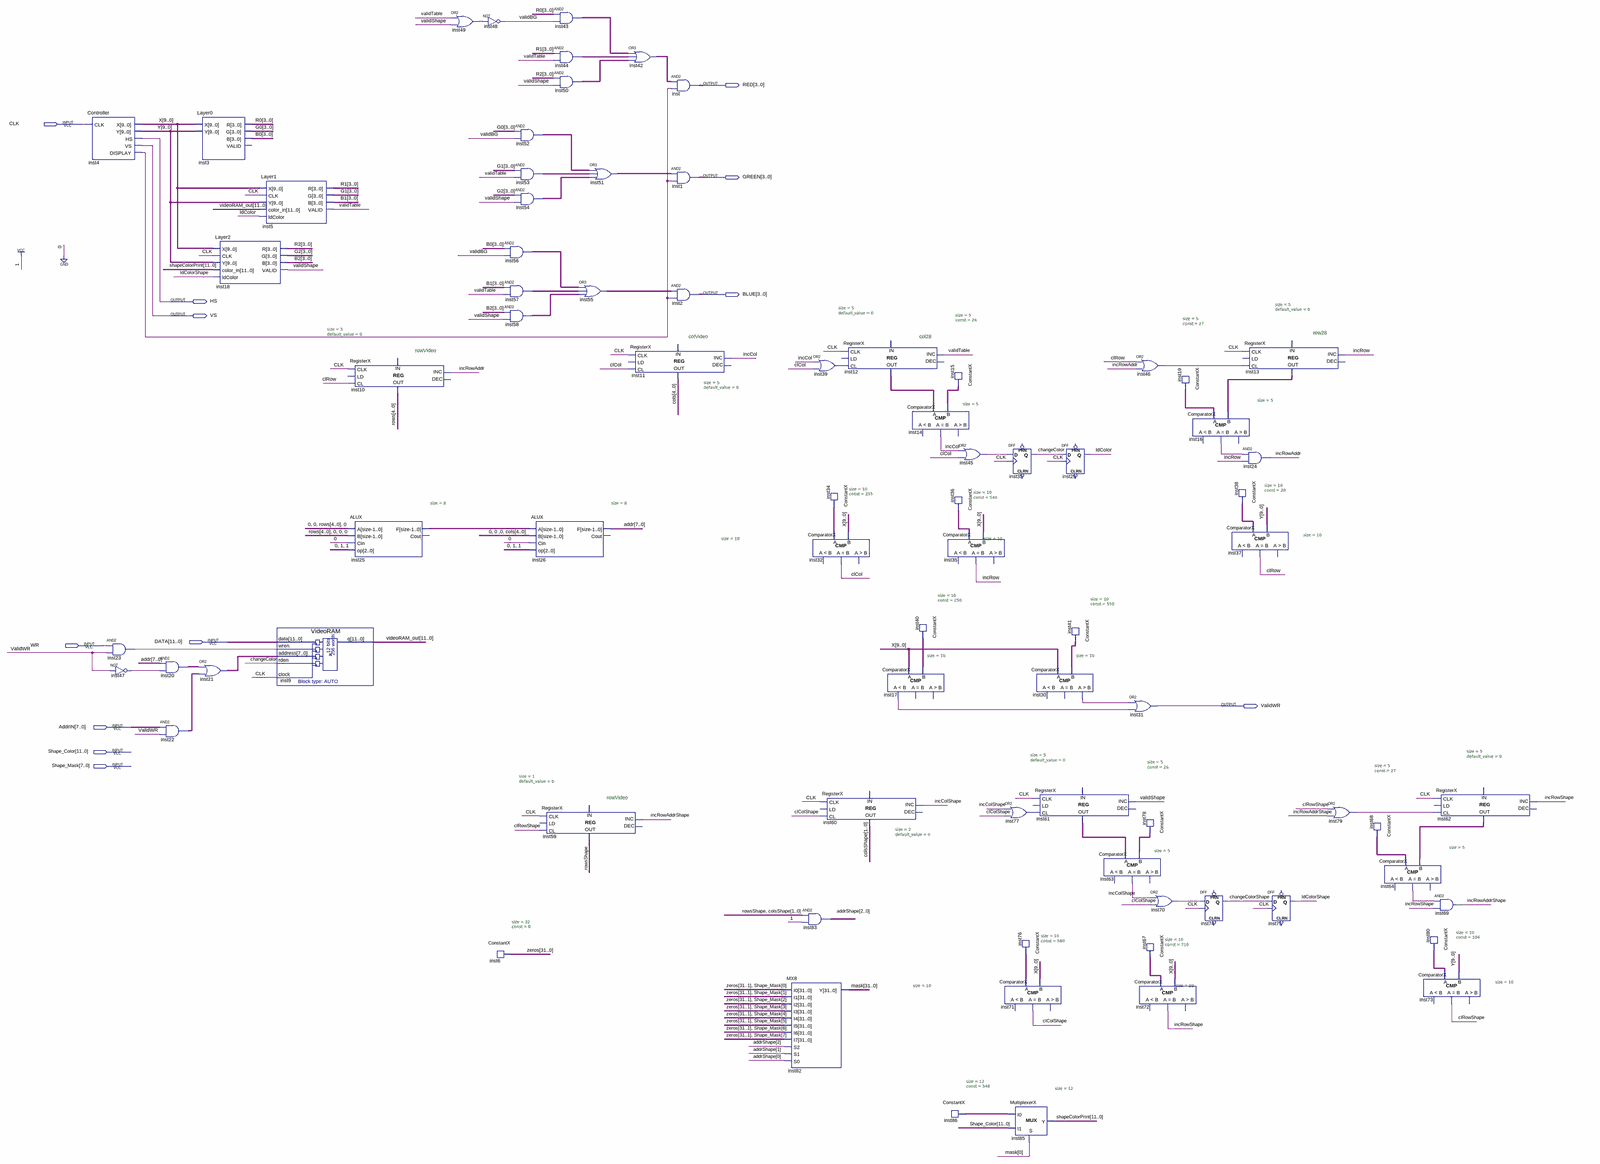
[diagram p0: schematic sheet, whole]
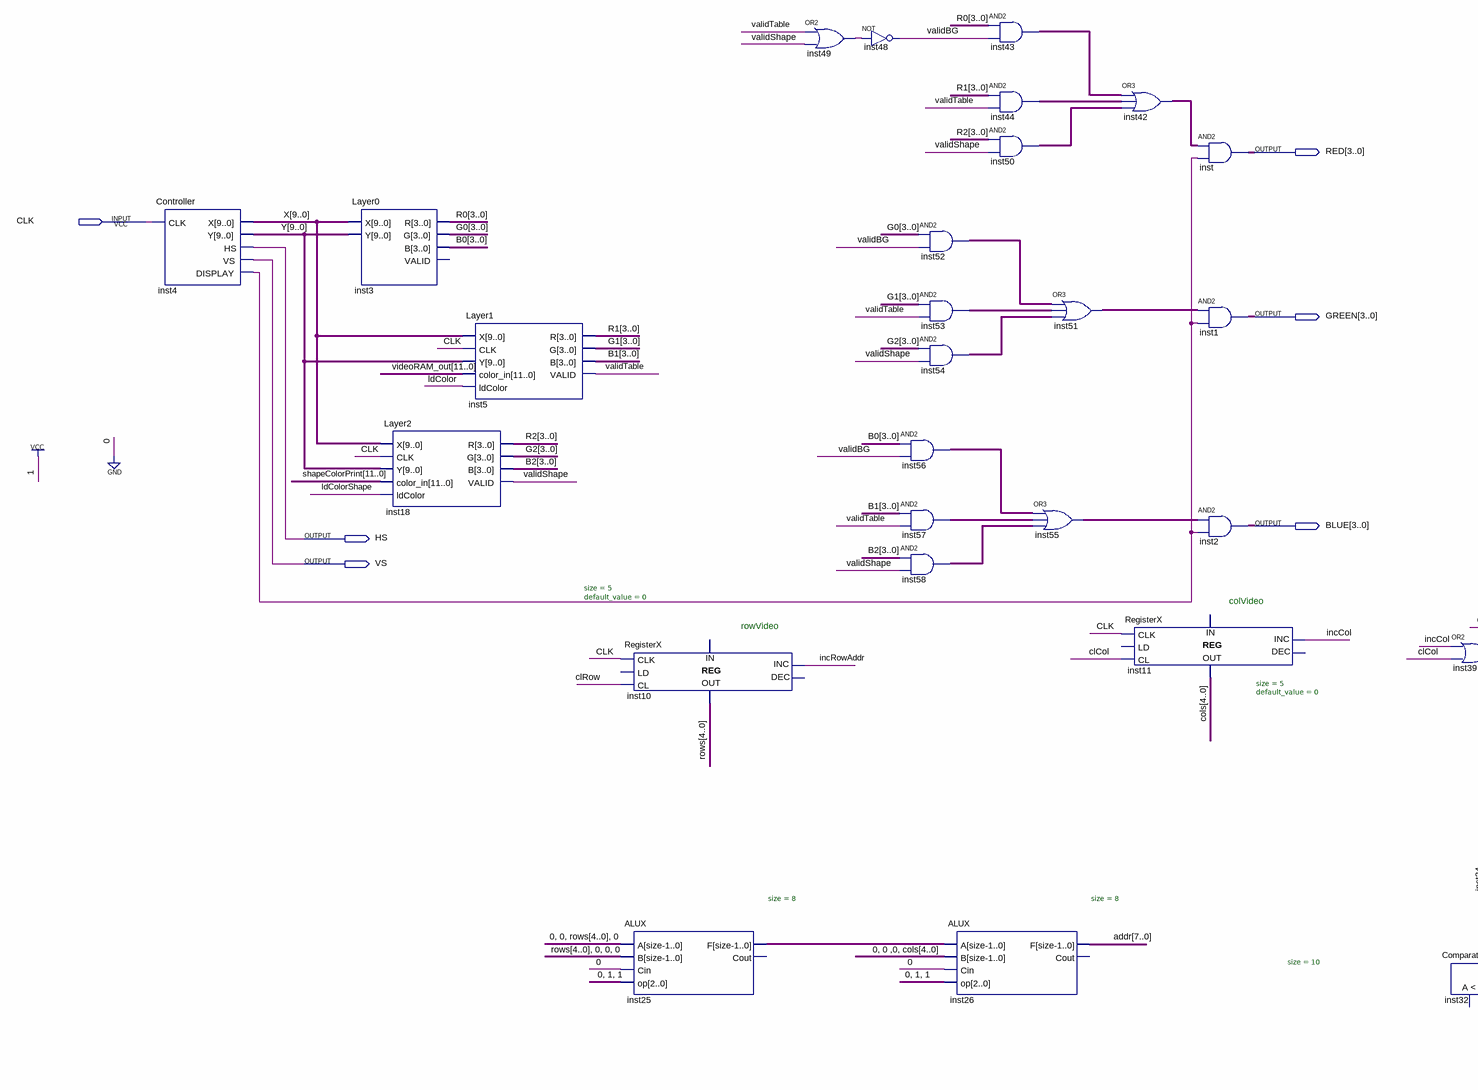
[diagram p1: schematic sheet, upper left part]
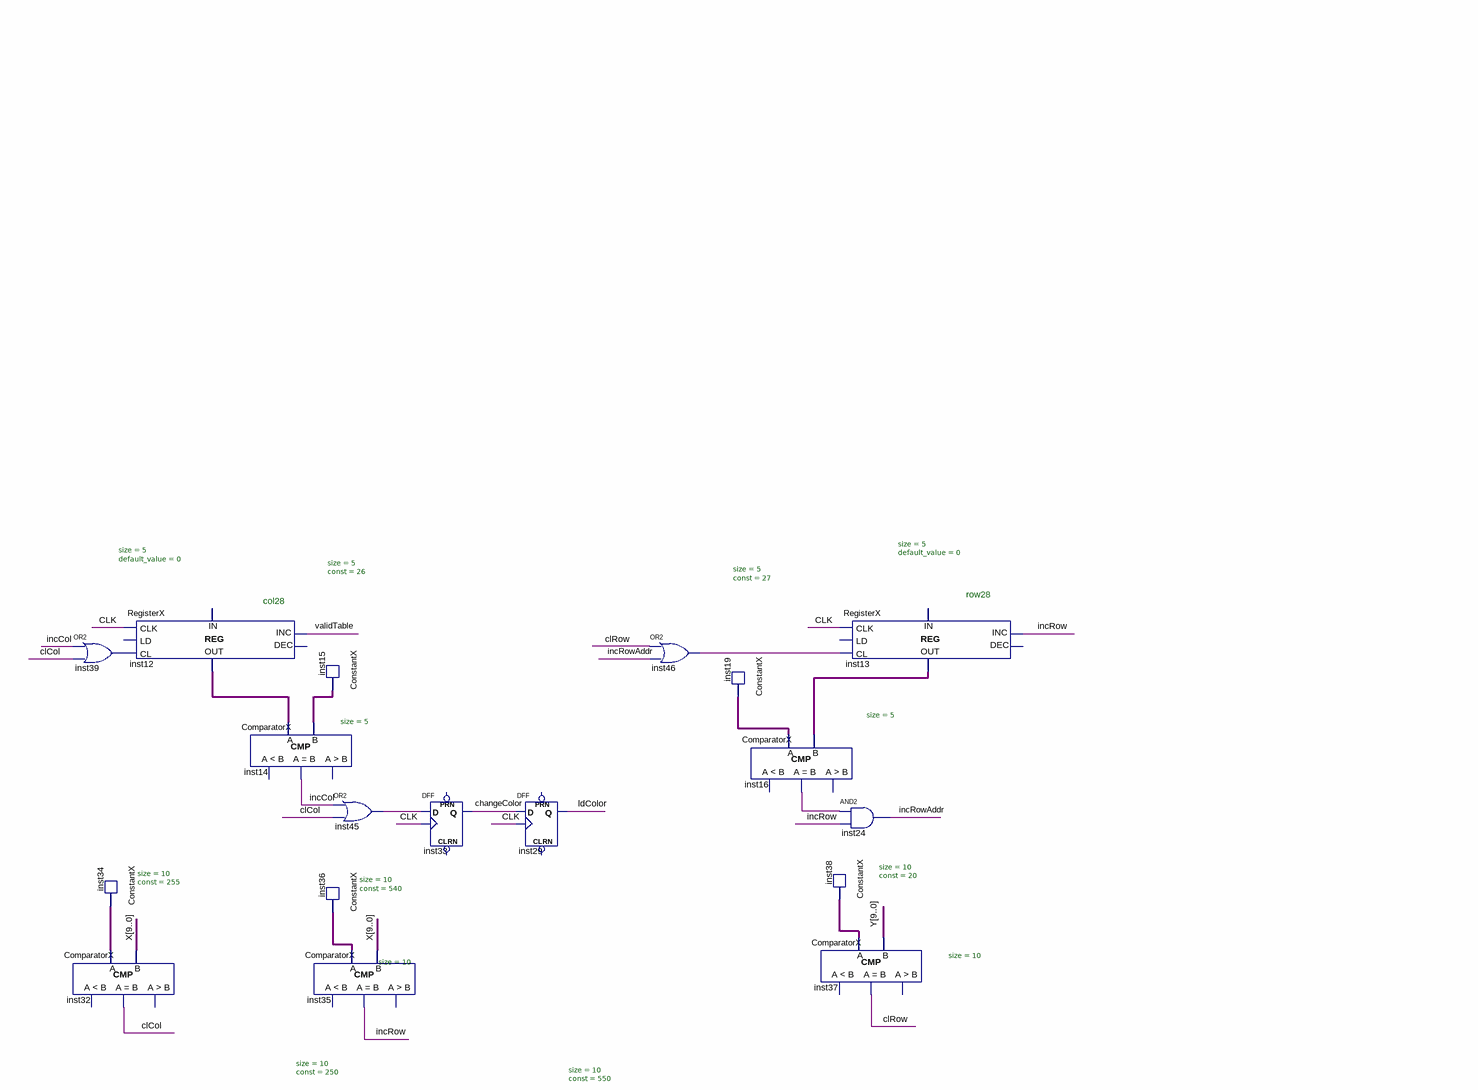
[diagram p2: schematic sheet, upper right part]
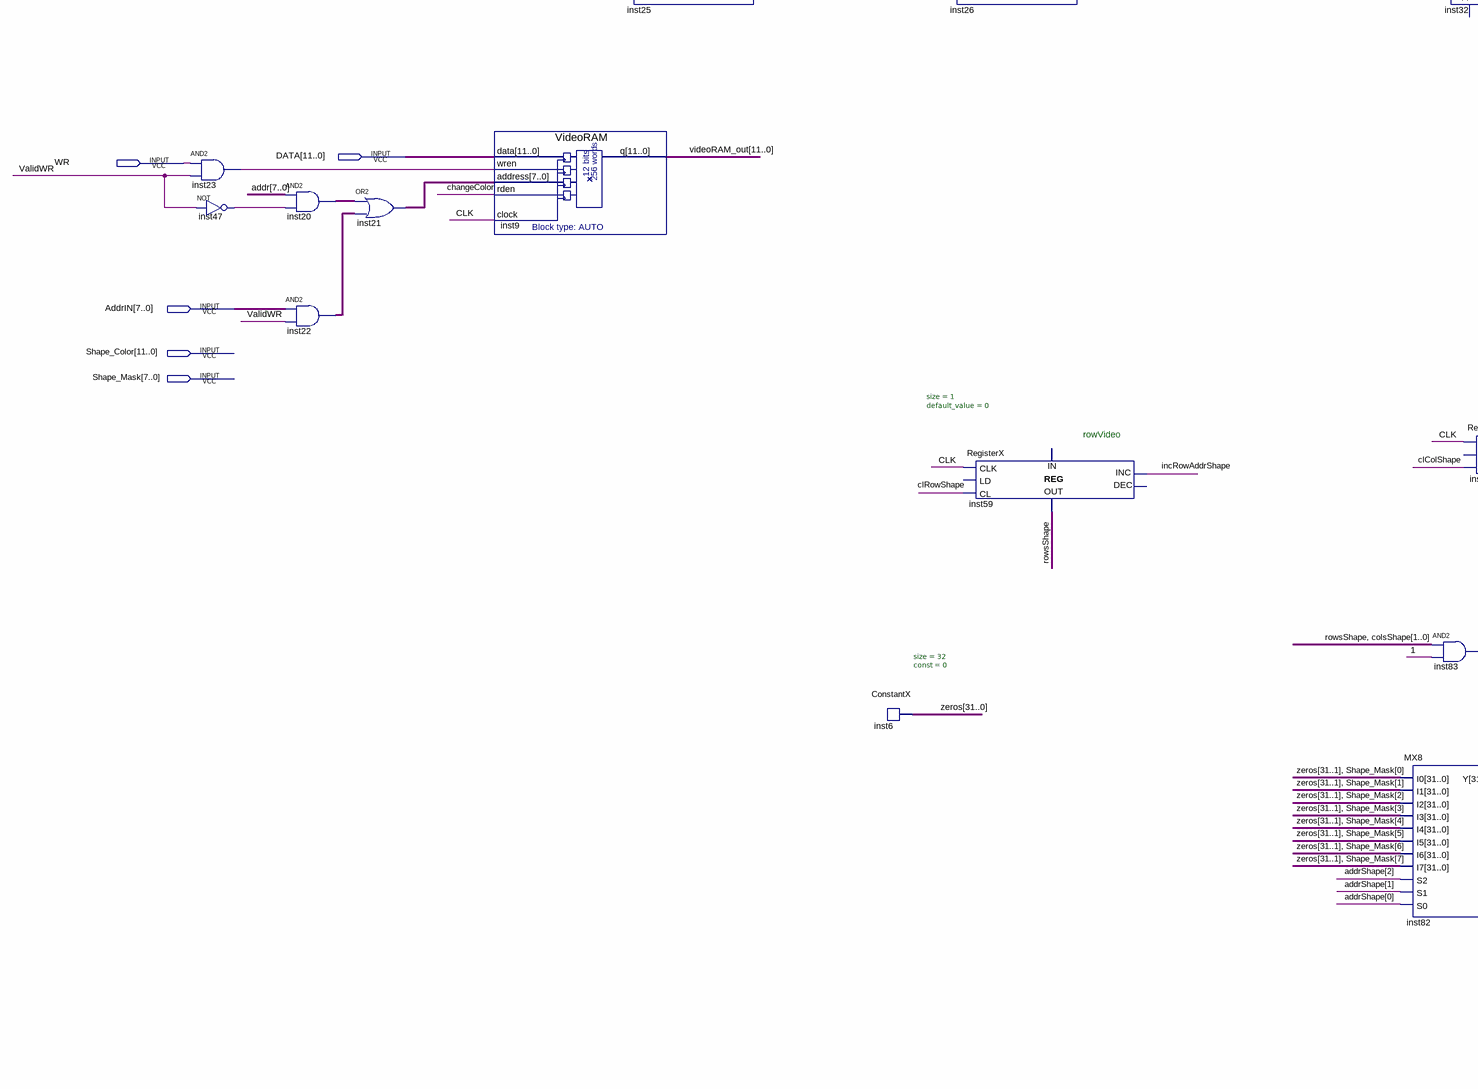
[diagram p3: schematic sheet, lower left part]
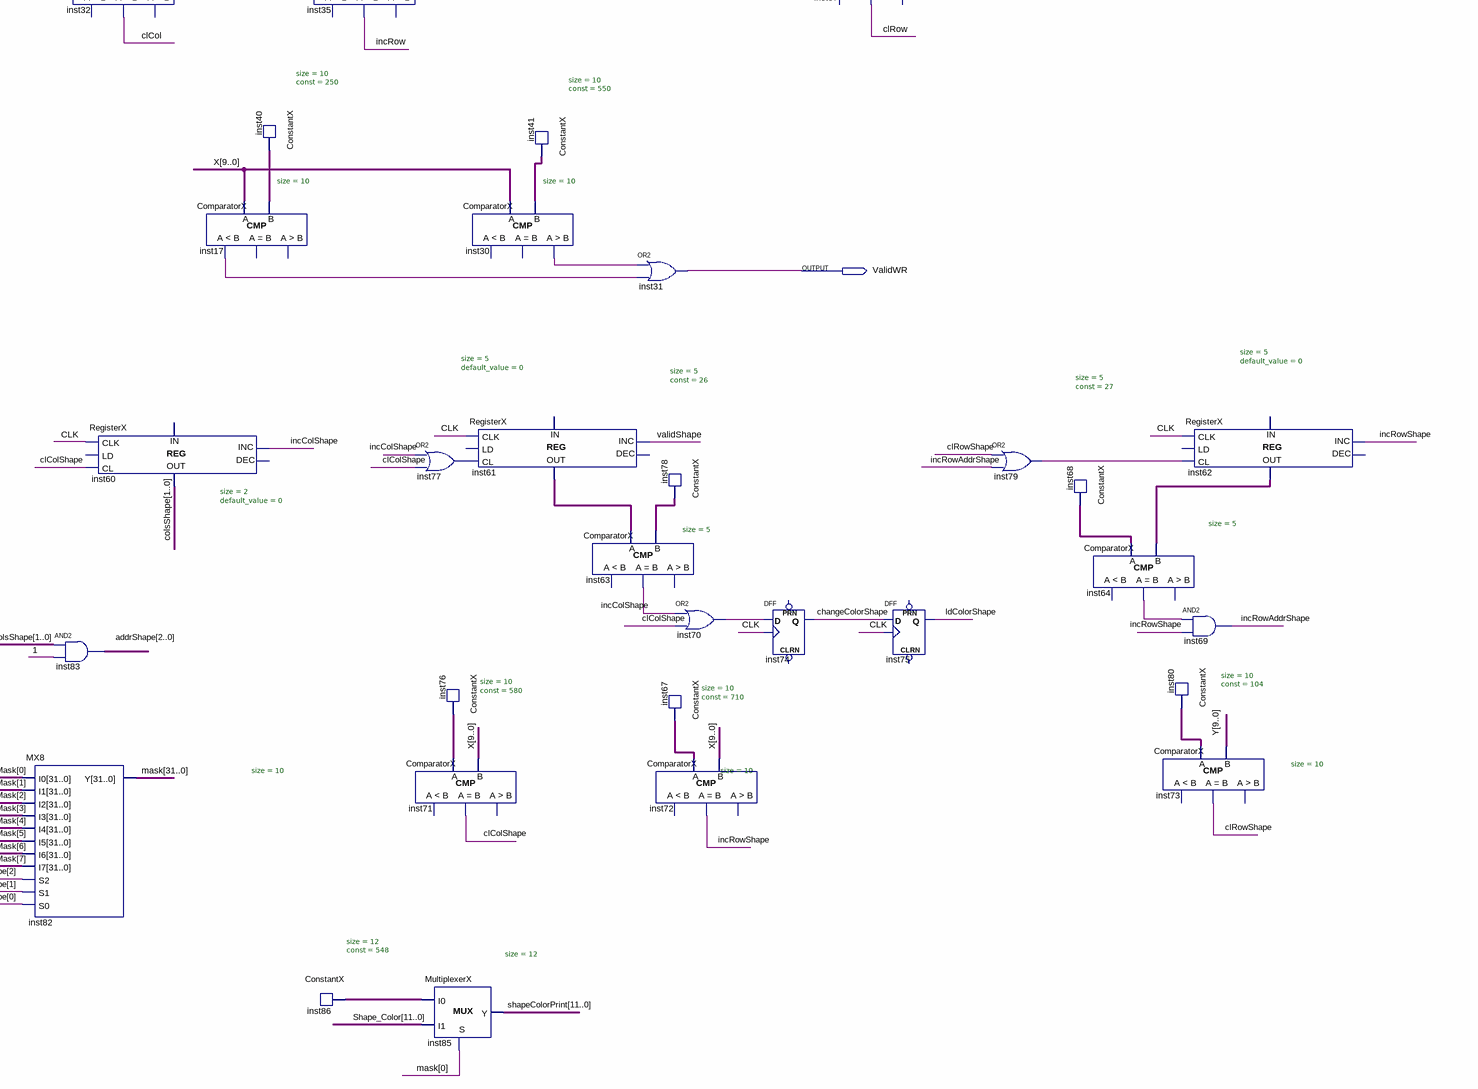
[diagram p4: schematic sheet, lower right part]
// Quartus schematic VGAPer.bdf as structural Verilog: 79 symbols, 12 pins
module VGAPer (
  input  CLK,
  input  [11:0] DATA,
  input  WR,
  input  [7:0] AddrIN,
  input  [11:0] Shape_Color,
  input  [7:0] Shape_Mask,
  output [3:0] RED,
  output [3:0] GREEN,
  output [3:0] BLUE,
  output HS,
  output VS,
  output ValidWR
);

  wire changeColor, changeColorShape, clCol, clColShape, clRow, clRowShape, incCol, incColShape, incRow,
       incRowAddr, incRowAddrShape, incRowShape, inst4_display, inst16_eq, inst17_ls, inst23_out, inst30_gr,
       inst39_out, inst45_out, inst46_out, inst47_out, inst49_out, inst64_eq, inst70_out, inst77_out,
       inst79_out, ldColor, ldColorShape, rowsShape, validBG, validShape, validTable;
  wire [1:0] colsShape;
  wire [2:0] addrShape;
  wire [3:0] B0, B1, B2, G0, G1, G2, inst42_out, inst43_out, inst44_out, inst50_out, inst51_out, inst52_out,
       inst53_out, inst54_out, inst55_out, inst56_out, inst57_out, inst58_out, R0, R1, R2;
  wire [4:0] cols, inst12_data_out, inst13_data_out, inst15_data_out, inst19_data_out, inst61_data_out,
       inst62_data_out, inst68_data_out, inst78_data_out, rows;
  wire [7:0] addr, inst20_out, inst21_out, inst22_out, inst25_f;
  wire [9:0] inst34_data_out, inst36_data_out, inst38_data_out, inst40_data_out, inst41_data_out,
       inst67_data_out, inst76_data_out, inst80_data_out, X, Y;
  wire [11:0] inst86_data_out, shapeColorPrint, videoRAM_out;
  wire [31:0] mask, zeros;

  Controller inst4 (.CLK(CLK), .X(X), .Y(Y), .HS(HS), .VS(VS), .DISPLAY(inst4_display));
  and inst23 (inst23_out, WR, ValidWR);
  not inst47 (inst47_out, ValidWR);
  assign inst20_out = addr & {8{inst47_out}};  // AND2 inst20, 8 bits wide
  assign inst22_out = AddrIN & {8{ValidWR}};  // AND2 inst22, 8 bits wide
  Layer0 inst3 (.X(X), .Y(Y), .R(R0), .G(G0), .B(B0));  // open: VALID
  assign inst21_out = inst20_out | inst22_out;  // OR2 inst21, 8 bits wide
  Layer2 inst18 (
    .X(X), .CLK(CLK), .Y(Y), .color_in(shapeColorPrint), .ldColor(ldColorShape), .R(R2), .G(G2), .B(B2),
    .VALID(validShape));
  Layer1 inst5 (
    .X(X), .CLK(CLK), .Y(Y), .color_in(videoRAM_out), .ldColor(ldColor), .R(R1), .G(G1), .B(B1),
    .VALID(validTable));
  VideoRAM inst9 (
    .data(DATA), .wren(inst23_out), .address(inst21_out), .rden(changeColor), .clock(CLK), .q(videoRAM_out));
  RegisterX #(.size(5), .default_value(0)) inst10 (
    .CLK(CLK), .CL(clRow), .INC(incRowAddr), .DATA_OUT(rows));  // open: LD, DEC, DATA_IN
  ALUX #(.size(8)) inst25 (
    .A({2'b00, rows, 1'b0}), .B({rows, 3'b000}), .Cin(1'b0), .op(3'b011), .F(inst25_f));  // open: Cout
  or inst49 (inst49_out, validTable, validShape);
  not inst48 (validBG, inst49_out);
  ConstantX #(.size(32), .\const (0)) inst6 (.DATA_OUT(zeros));
  assign inst52_out = G0 & {4{validBG}};  // AND2 inst52, 4 bits wide
  assign inst53_out = G1 & {4{validTable}};  // AND2 inst53, 4 bits wide
  assign inst54_out = G2 & {4{validShape}};  // AND2 inst54, 4 bits wide
  assign inst56_out = B0 & {4{validBG}};  // AND2 inst56, 4 bits wide
  assign inst57_out = B1 & {4{validTable}};  // AND2 inst57, 4 bits wide
  assign inst58_out = B2 & {4{validShape}};  // AND2 inst58, 4 bits wide
  ALUX #(.size(8)) inst26 (.A(inst25_f), .B({3'b000, cols}), .Cin(1'b0), .op(3'b011), .F(addr));  // open: Cout
  RegisterX #(.size(1), .default_value(0)) inst59 (
    .CLK(CLK), .CL(clRowShape), .INC(incRowAddrShape), .DATA_OUT(rowsShape));  // open: LD, DEC, DATA_IN
  assign inst43_out = R0 & {4{validBG}};  // AND2 inst43, 4 bits wide
  assign inst44_out = R1 & {4{validTable}};  // AND2 inst44, 4 bits wide
  assign inst50_out = R2 & {4{validShape}};  // AND2 inst50, 4 bits wide
  assign inst51_out = inst52_out | inst53_out | inst54_out;  // OR3 inst51, 4 bits wide
  assign inst55_out = inst56_out | inst57_out | inst58_out;  // OR3 inst55, 4 bits wide
  assign inst42_out = inst43_out | inst44_out | inst50_out;  // OR3 inst42, 4 bits wide
  RegisterX #(.size(5), .default_value(0)) inst11 (
    .CLK(CLK), .CL(clCol), .INC(incCol), .DATA_OUT(cols));  // open: LD, DEC, DATA_IN
  assign RED = inst42_out & {4{inst4_display}};  // AND2 inst, 4 bits wide
  assign GREEN = inst51_out & {4{inst4_display}};  // AND2 inst1, 4 bits wide
  assign BLUE = inst55_out & {4{inst4_display}};  // AND2 inst2, 4 bits wide
  assign addrShape = {rowsShape, colsShape} & 3'b111;  // AND2 inst83, 3 bits wide
  MX8 inst82 (
    .I0({zeros[31:1], Shape_Mask[0]}), .I1({zeros[31:1], Shape_Mask[1]}), .I2({zeros[31:1], Shape_Mask[2]}),
    .I3({zeros[31:1], Shape_Mask[3]}), .I4({zeros[31:1], Shape_Mask[4]}), .I5({zeros[31:1], Shape_Mask[5]}),
    .I6({zeros[31:1], Shape_Mask[6]}), .I7({zeros[31:1], Shape_Mask[7]}), .S2(addrShape[2]),
    .S1(addrShape[1]), .S0(addrShape[0]), .Y(mask));
  or inst39 (inst39_out, incCol, clCol);
  ConstantX #(.size(10), .\const (255)) inst34 (.DATA_OUT(inst34_data_out));
  ComparatorX #(.size(10)) inst32 (.A(inst34_data_out), .B(X), .EQ(clCol));  // open: LS, GR
  RegisterX #(.size(2), .default_value(0)) inst60 (
    .CLK(CLK), .CL(clColShape), .INC(incColShape), .DATA_OUT(colsShape));  // open: LD, DEC, DATA_IN
  RegisterX #(.size(5), .default_value(0)) inst12 (
    .CLK(CLK), .CL(inst39_out), .INC(validTable), .DATA_OUT(inst12_data_out));  // open: LD, DEC, DATA_IN
  ComparatorX #(.size(10)) inst17 (.A(X), .B(inst40_data_out), .LS(inst17_ls));  // open: EQ, GR
  ComparatorX #(.size(5)) inst14 (.A(inst12_data_out), .B(inst15_data_out), .EQ(incCol));  // open: LS, GR
  ConstantX #(.size(10), .\const (250)) inst40 (.DATA_OUT(inst40_data_out));
  ComparatorX #(.size(10)) inst35 (.A(inst36_data_out), .B(X), .EQ(incRow));  // open: LS, GR
  ConstantX #(.size(12), .\const (548)) inst86 (.DATA_OUT(inst86_data_out));
  ConstantX #(.size(5), .\const (26)) inst15 (.DATA_OUT(inst15_data_out));
  or inst45 (inst45_out, incCol, clCol);
  ConstantX #(.size(10), .\const (540)) inst36 (.DATA_OUT(inst36_data_out));
  ComparatorX #(.size(10)) inst71 (.A(inst76_data_out), .B(X), .EQ(clColShape));  // open: LS, GR
  DFF inst33 (.CLK(CLK), .D(inst45_out), .Q(changeColor));  // open: CLRN, PRN
  ComparatorX #(.size(10)) inst30 (.A(X), .B(inst41_data_out), .GR(inst30_gr));  // open: LS, EQ
  or inst77 (inst77_out, incColShape, clColShape);
  ConstantX #(.size(10), .\const (580)) inst76 (.DATA_OUT(inst76_data_out));
  MultiplexerX #(.size(12)) inst85 (.S(mask[0]), .I0(inst86_data_out), .I1(Shape_Color), .Y(shapeColorPrint));
  RegisterX #(.size(5), .default_value(0)) inst61 (
    .CLK(CLK), .CL(inst77_out), .INC(validShape), .DATA_OUT(inst61_data_out));  // open: LD, DEC, DATA_IN
  DFF inst29 (.CLK(CLK), .D(changeColor), .Q(ldColor));  // open: CLRN, PRN
  ConstantX #(.size(10), .\const (550)) inst41 (.DATA_OUT(inst41_data_out));
  ComparatorX #(.size(5)) inst63 (.A(inst61_data_out), .B(inst78_data_out), .EQ(incColShape));  // open: LS, GR
  or inst46 (inst46_out, clRow, incRowAddr);
  or inst31 (ValidWR, inst30_gr, inst17_ls);
  ConstantX #(.size(5), .\const (26)) inst78 (.DATA_OUT(inst78_data_out));
  ConstantX #(.size(10), .\const (710)) inst67 (.DATA_OUT(inst67_data_out));
  ComparatorX #(.size(10)) inst72 (.A(inst67_data_out), .B(X), .EQ(incRowShape));  // open: LS, GR
  or inst70 (inst70_out, incColShape, clColShape);
  ConstantX #(.size(5), .\const (27)) inst19 (.DATA_OUT(inst19_data_out));
  ComparatorX #(.size(5)) inst16 (.A(inst19_data_out), .B(inst13_data_out), .EQ(inst16_eq));  // open: LS, GR
  DFF inst74 (.CLK(CLK), .D(inst70_out), .Q(changeColorShape));  // open: CLRN, PRN
  ComparatorX #(.size(10)) inst37 (.A(inst38_data_out), .B(Y), .EQ(clRow));  // open: LS, GR
  RegisterX #(.size(5), .default_value(0)) inst13 (
    .CLK(CLK), .CL(inst46_out), .INC(incRow), .DATA_OUT(inst13_data_out));  // open: LD, DEC, DATA_IN
  and inst24 (incRowAddr, inst16_eq, incRow);
  ConstantX #(.size(10), .\const (20)) inst38 (.DATA_OUT(inst38_data_out));
  DFF inst75 (.CLK(CLK), .D(changeColorShape), .Q(ldColorShape));  // open: CLRN, PRN
  or inst79 (inst79_out, clRowShape, incRowAddrShape);
  ConstantX #(.size(5), .\const (27)) inst68 (.DATA_OUT(inst68_data_out));
  ComparatorX #(.size(5)) inst64 (.A(inst68_data_out), .B(inst62_data_out), .EQ(inst64_eq));  // open: LS, GR
  ConstantX #(.size(10), .\const (104)) inst80 (.DATA_OUT(inst80_data_out));
  ComparatorX #(.size(10)) inst73 (.A(inst80_data_out), .B(Y), .EQ(clRowShape));  // open: LS, GR
  RegisterX #(.size(5), .default_value(0)) inst62 (
    .CLK(CLK), .CL(inst79_out), .INC(incRowShape), .DATA_OUT(inst62_data_out));  // open: LD, DEC, DATA_IN
  and inst69 (incRowAddrShape, inst64_eq, incRowShape);

  // Notes on the sheet:
  //   row28
  //   colVideo
  //   col28
  //   rowVideo
  //   rowVideo
endmodule
